# EAGLE design BEL (EAGLE 6.6.0)
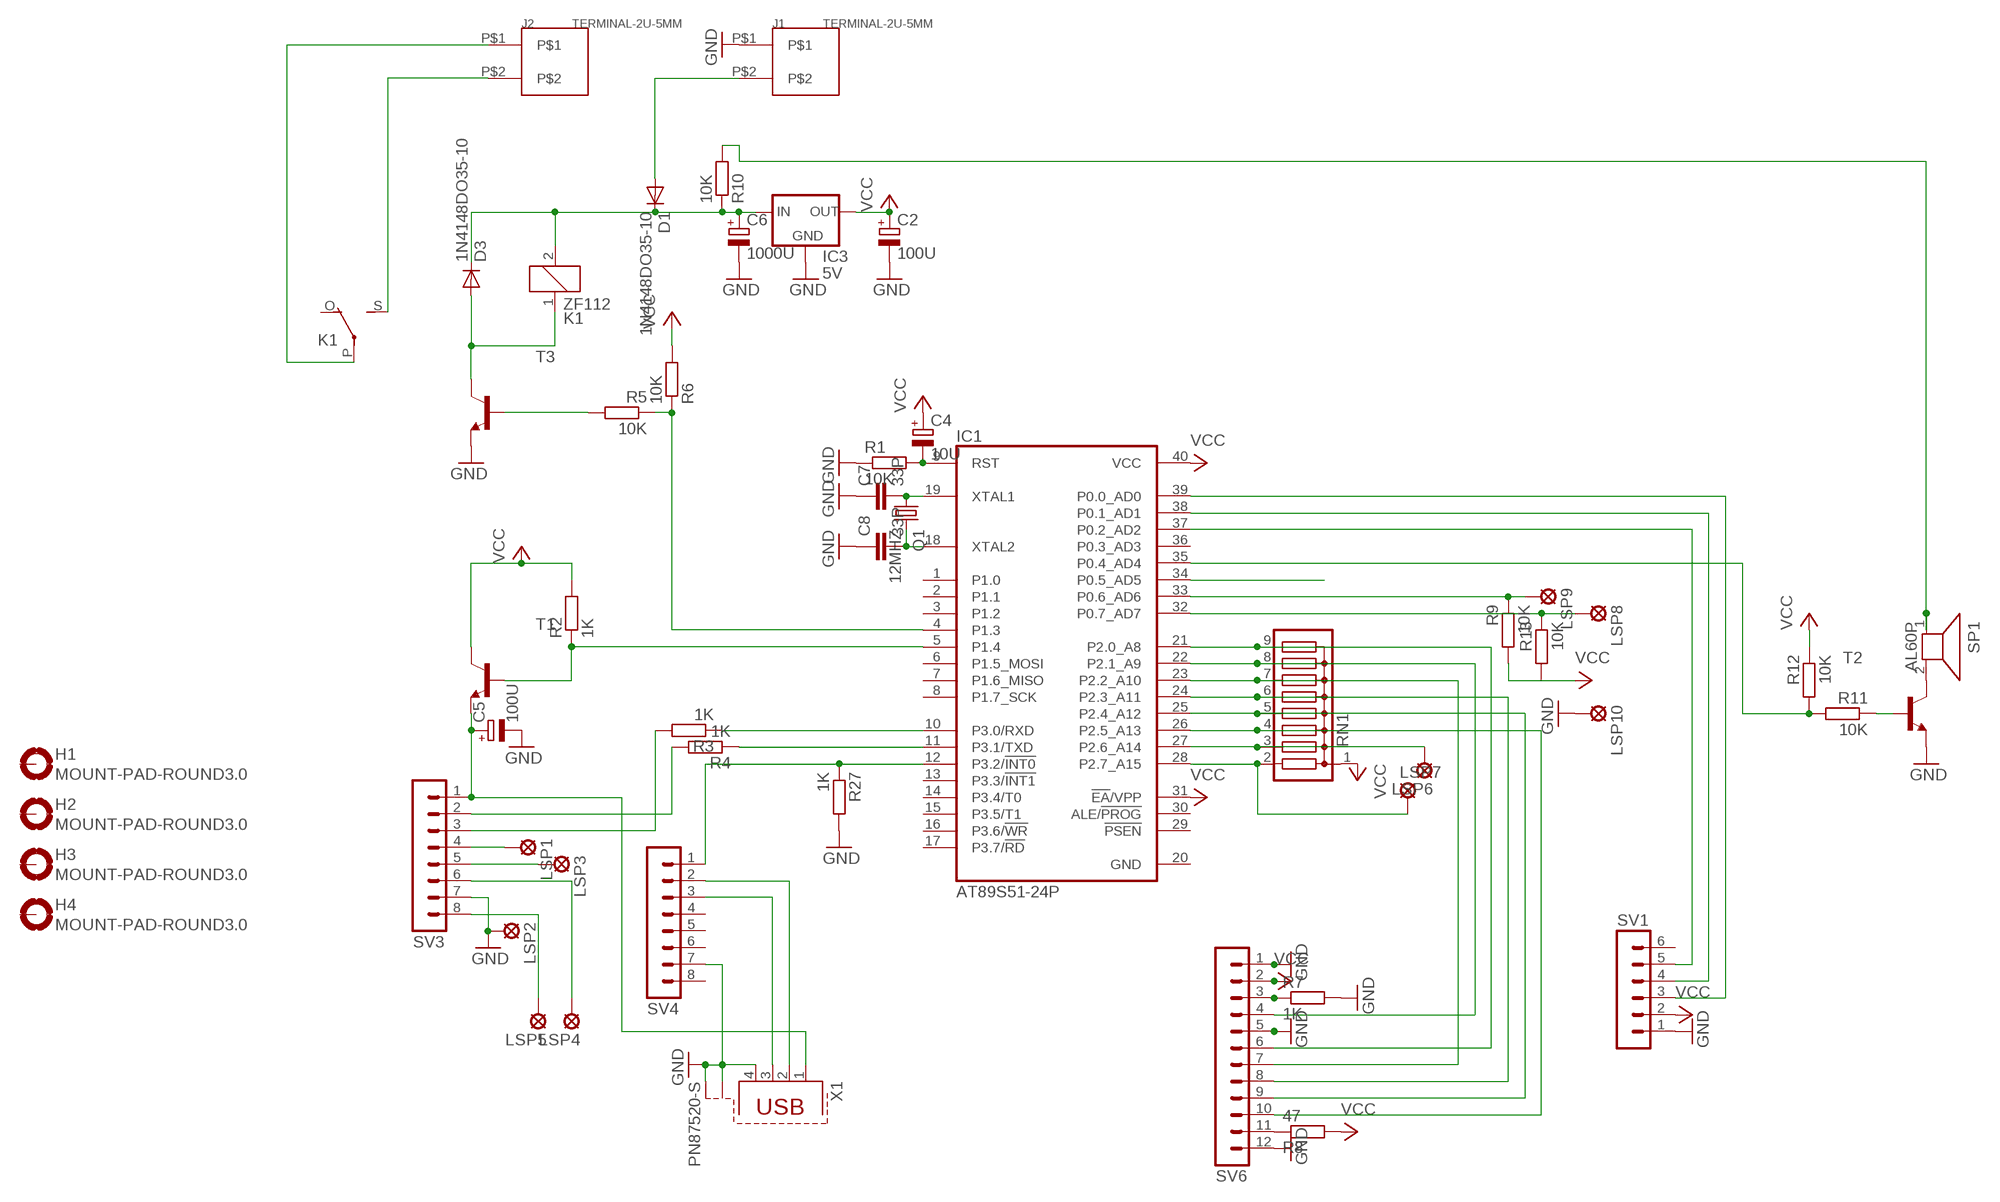
[diagram p0: schematic, sheet 1]

## Parts
C2  100U  CPOL-EUE2.5-5  [E2,5-5]
C4  10U  CPOL-EUE2.5-5  [E2,5-5]
C5  100U  CPOL-EUE2.5-5  [E2,5-5]
C6  1000U  CPOL-EUE5-8.5  [E5-8,5]
C7  33P  C-EU025-025X050  [C025-025X050]
C8  33P  C-EU025-025X050  [C025-025X050]
D1  1N4148DO35-10  [DO35-10]
D3  1N4148DO35-10  [DO35-10]
H1  MOUNT-PAD-ROUND3.0  [3,0-PAD]
H2  MOUNT-PAD-ROUND3.0  [3,0-PAD]
H3  MOUNT-PAD-ROUND3.0  [3,0-PAD]
H4  MOUNT-PAD-ROUND3.0  [3,0-PAD]
IC1  AT89S51-24P  [DIL40]
IC3  5V  78XXS  [78XXS]
J1  TERMINAL-2U-5MM  [TERMINAL-2U-5MM]
J2  TERMINAL-2U-5MM  [TERMINAL-2U-5MM]
K1  ZF112  [ZF112]
LSP1  SE11  [SE11]
LSP2  SE11  [SE11]
LSP3  SE11  [SE11]
LSP4  SE11  [SE11]
LSP5  SE11  [SE11]
LSP6  MCS10B  [MCS10B]
LSP7  MCS10B  [MCS10B]
LSP8  MCS10B  [MCS10B]
LSP9  MCS10B  [MCS10B]
LSP10  MCS10B  [MCS10B]
Q1  12MHZ  CRYSTALHC49S  [HC49/S]
R1  10K  R-EU_0207/10  [0207/10]
R2  1K  R-EU_0207/10  [0207/10]
R3  1K  R-EU_0207/10  [0207/10]
R4  1K  R-EU_0207/10  [0207/10]
R5  10K  R-EU_0207/10  [0207/10]
R6  10K  R-EU_0207/10  [0207/10]
R7  1K  R-EU_0207/10  [0207/10]
R8  47  R-EU_0207/10  [0207/10]
R9  10K  R-EU_0207/10  [0207/10]
R10  10K  R-EU_0207/10  [0207/10]
R11  10K  R-EU_0207/10  [0207/10]
R12  10K  R-EU_0207/10  [0207/10]
R13  10K  R-EU_0207/10  [0207/10]
R27  1K  R-EU_0207/10  [0207/10]
RN1  G08R  [SIL9]
SP1  AL60P  [AL60P]
SV1  MA06-1  [MA06-1]
SV3  MA08-1  [MA08-1]
SV4  MA08-1  [MA08-1]
SV6  MA12-1  [MA12-1]
T1  BC547-NPN-TO92-CBE  [TO92-CBE]
T2  BC547-NPN-TO92-CBE  [TO92-CBE]
T3  BC547-NPN-TO92-CBE  [TO92-CBE]
X1  PN87520-S  [PN87520-S]

## Nets
GND: C2.- C5.- C6.- C7.1 C8.1 IC3.GND J1.P$1 LSP2.MP LSP10.MP R1.1 R7.2 R27.2 SV1.1 SV3.7 SV4.7 SV6.1 SV6.5 SV6.12 T2.E T3.E X1.4 X1.S1 X1.S2
N$1: C8.2 IC1.18(XTAL2) Q1.2
N$2: C7.2 IC1.19(XTAL1) Q1.1
N$3: C4.- IC1.9(RST) R1.2
N$4: R10.2 SP1.1
N$5: D3.A K1.1 T3.C
N$6: C5.+ SV3.1 T1.E X1.1
N$7: IC1.5(P1.4) R2.1 T1.B
N$8: SP1.2 T2.C
N$9: R4.2 SV3.2
N$10: R3.2 SV3.3
N$11: IC1.11(P3.1/TXD) R4.1
N$12: IC1.10(P3.0/RXD) R3.1
N$13: IC1.12(P3.2/!INT0) R27.1 SV4.1
N$14: IC1.26(P2.5_A13) RN1.4 SV6.10
N$15: IC1.38(P0.1_AD1) SV1.4
N$16: SV4.2 X1.2
N$17: SV4.3 X1.3
N$18: LSP4.MP SV3.6
N$19: IC1.23(P2.2_A10) RN1.7 SV6.7
N$20: R5.2 T3.B
N$21: IC1.4(P1.3) R5.1 R6.1
N$22: D1.A J1.P$2
N$23: J2.P$2 K1.S(2:S)
N$24: J2.P$1 K1.P(2:P)
N$25: IC1.37(P0.2_AD2) SV1.5
N$27: R7.1 SV6.3
N$28: IC1.39(P0.0_AD0) SV1.3
N$29: R11.1 T2.B
N$30: C6.+ D1.C D3.C IC3.IN K1.2 R10.1
N$32: LSP5.MP SV3.8
N$33: LSP1.MP SV3.4
N$34: LSP3.MP SV3.5
N$37: R8.1 SV6.11
N$38: IC1.24(P2.3_A11) RN1.6 SV6.8
N$39: IC1.21(P2.0_A8) RN1.9 SV6.6
N$40: IC1.22(P2.1_A9) RN1.8 SV6.4
N$42: IC1.35(P0.4_AD4) R11.2 R12.2
N$43: IC1.34(P0.5_AD5)
N$44: IC1.33(P0.6_AD6) LSP9.MP R9.1
N$45: IC1.32(P0.7_AD7) LSP8.MP R13.1
N$46: IC1.28(P2.7_A15) LSP7.MP RN1.2
N$47: IC1.27(P2.6_A14) LSP6.MP RN1.3
N$49: IC1.25(P2.4_A12) RN1.5 SV6.9
VCC: C2.+ C4.+ IC1.31(!EA!/VPP) IC1.40(VCC) IC3.OUT R2.2 R6.2 R8.2 R9.2 R12.1 R13.2 RN1.1 SV1.2 SV6.2 T1.C
Unconnected: H1.B3,0(MOUNT) H2.B3,0(MOUNT) H3.B3,0(MOUNT) H4.B3,0(MOUNT) IC1.1(P1.0) IC1.2(P1.1) IC1.3(P1.2) IC1.6(P1.5_MOSI) IC1.7(P1.6_MISO) IC1.8(P1.7_SCK) IC1.13(P3.3/!INT1) IC1.14(P3.4/T0) IC1.15(P3.5/T1) IC1.16(P3.6/!WR) IC1.17(P3.7/!RD) IC1.29(!PSEN) IC1.30(ALE/!PROG) IC1.36(P0.3_AD3) K1.O(2:O) SV1.6 SV4.4 SV4.5 SV4.6 SV4.8

## Power pins joined to a net without a drawn wire
GND: IC1.20(GND)

## Library data of the parts
C2 C4-C6 = resistor:CPOL-EU: POLARIZED CAPACITOR, European symbol
C7 C8 = resistor:C-EU: CAPACITOR, European symbol
D1 D3 = diode:1N4148: DIODE high speed (Philips)
H1-H4 = holes:MOUNT-PAD-ROUND: MOUNTING PAD, round
IC1 = atmel:AT89S51-*: 8-bit Microcontroller with 4K BytesIn-System Programmable Flash Source: http://www.atmel.com/dyn/resources/prod_documents/doc2487.pdf; MPN: AT89S51-24PU; OC_FARNELL: 1095739; OC_NEWARK: 96K6578
IC3 = v-reg:78XXS: VOLTAGE REGULATOR
J1 J2 = Itead_BP_110825.lbr:TERMINAL-2U-5MM: CON001
K1 = relay:ZF112: RELAY 1 x switch; OC_FARNELL: unknown; OC_NEWARK: unknown
LSP1-LSP5 = solpad:SE11: SOLDER PAD RTM, drill 1,1mm, distributor Buerklin, 07F810
LSP6-LSP10 = solpad:MCS10B: SOLDER PAD MC S1, distributor Buerklin, 15F505
Q1 = crystal:CRYSTAL: CRYSTAL; OC_FARNELL: 1667008; OC_NEWARK: unknown
R1-R13 R27 = resistor:R-EU_: RESISTOR, European symbol
RN1 = resistor-sil:G08R: SIL RESISTOR; OC_FARNELL: unknown; OC_NEWARK: unknown
SP1 = buzzer:AL60P: SPEAKER Source: Buerklin; OC_FARNELL: unknown; OC_NEWARK: unknown
SV1 = con-lstb:MA06-1: PIN HEADER; OC_FARNELL: unknown; OC_NEWARK: unknown
SV3 SV4 = con-lstb:MA08-1: PIN HEADER; OC_FARNELL: unknown; OC_NEWARK: unknown
SV6 = con-lstb:MA12-1: PIN HEADER; OC_FARNELL: unknown; OC_NEWARK: unknown
T1-T3 = transistor:*-NPN-: NPN Transistror BF959 corrected 2008.03.06
X1 = con-berg:PN87520-S; OC_FARNELL: unknown; OC_NEWARK: unknown

## Board
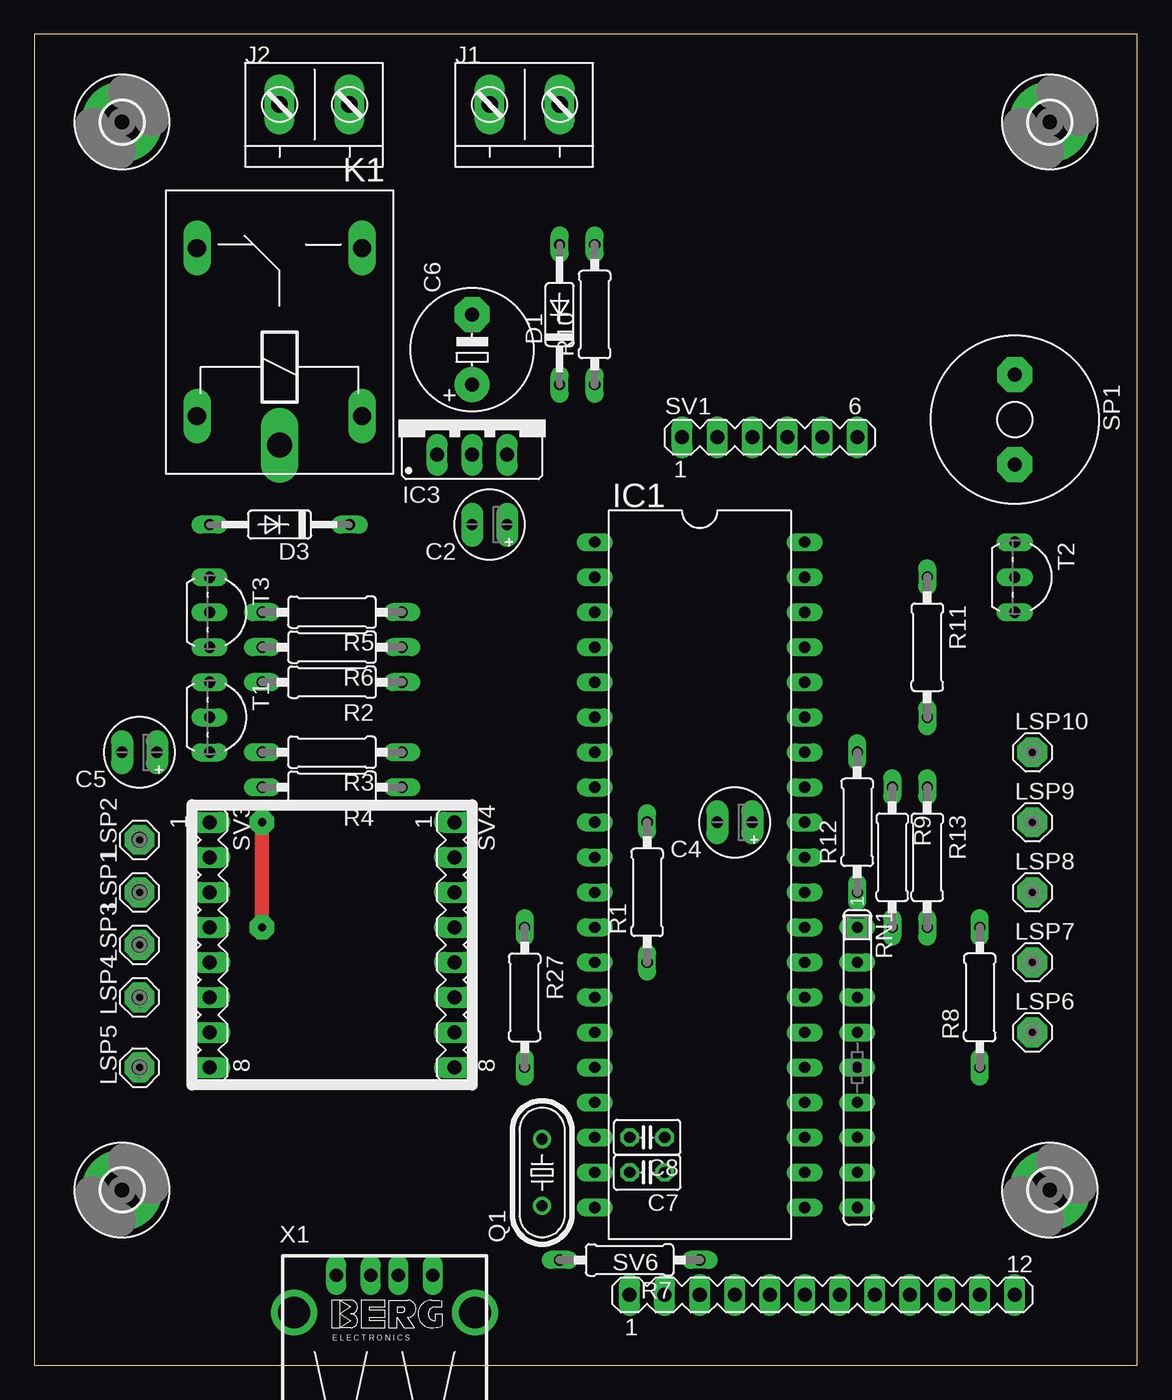
[diagram p1: board, top side]
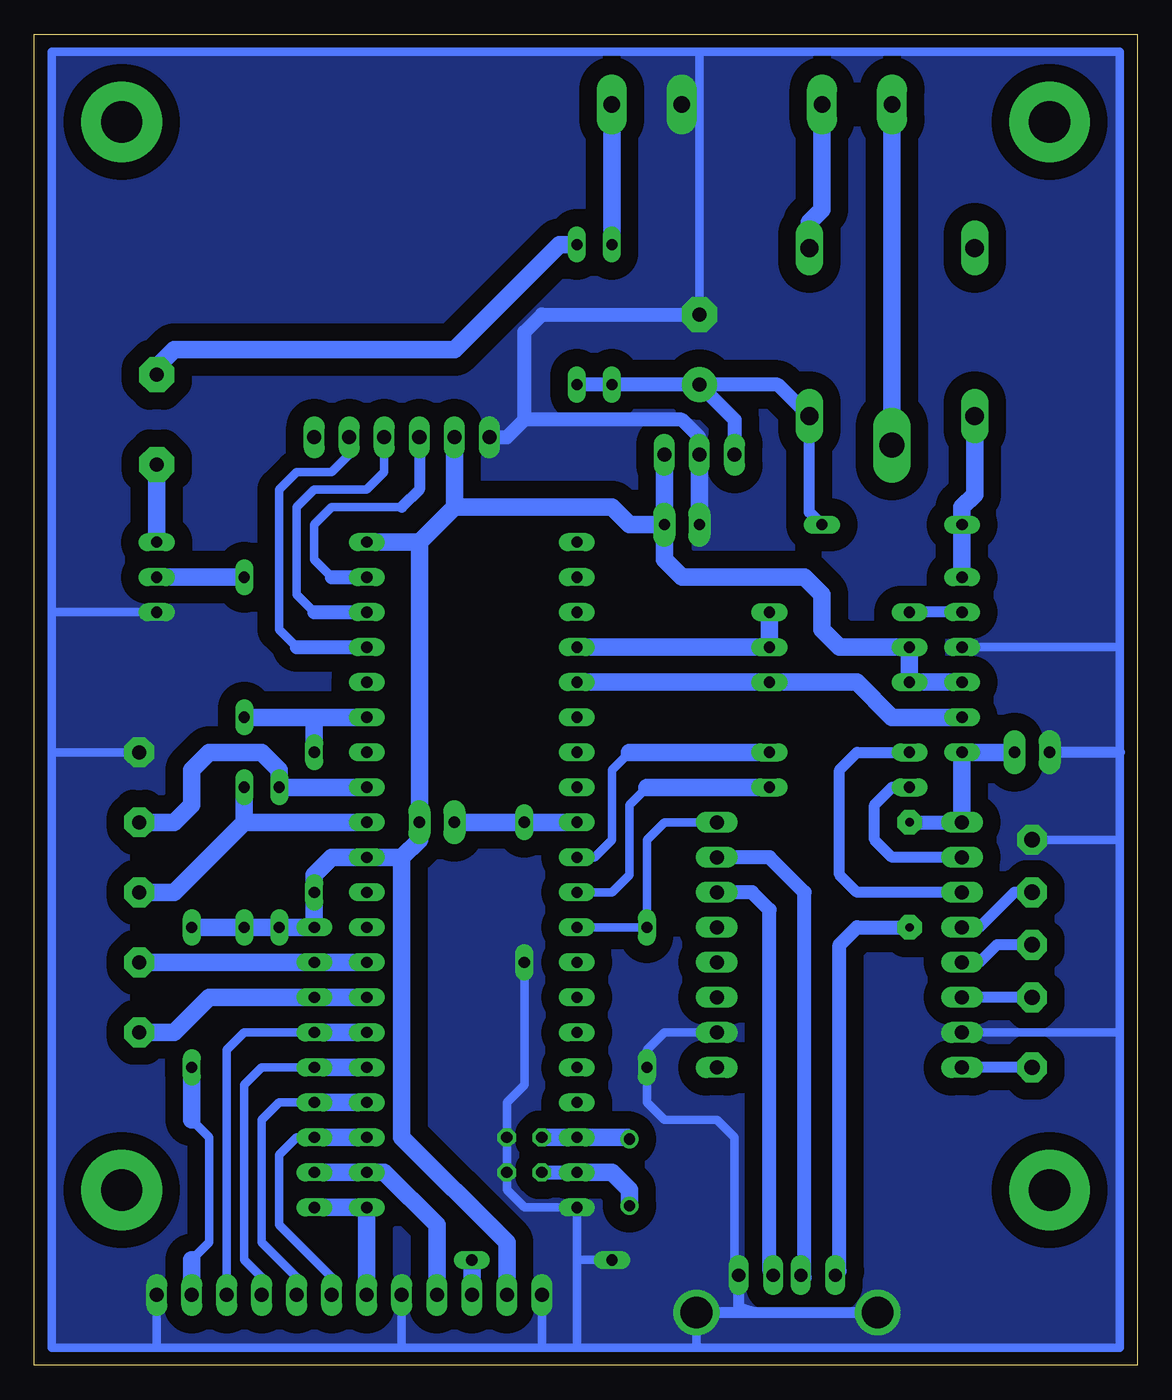
[diagram p2: board, bottom side, seen from below]

Size 79.99 x 96.52 mm. Coordinates in mm from the lower left corner, seen from the top.
Outline: 0,0 79.99,0 79.99,96.52 0,96.52 0,0
Copper layers (1*16): Top 0.035mm / dielectric 1.5mm / Bottom 0.035mm
Design rules "default": minimum track width 10mil, minimum drill 24mil, track to track 8mil, track to pad 8mil, pad to pad 8mil, via to via 8mil, smd to smd 8mil, copper to edge 40mil, drill to drill 8mil, minimum pad ring 10mil, minimum via ring 8mil, stop-mask expansion 4mil, vias tented up to drill 0mil, thermal gap 10mil

### Footprints (pad centres in the part's own frame; a part is rotated, then mirrored left to right if it is on the bottom)
E2,5-5 = drill 0.813 pad 1.6 long: + -1.27,0; - 1.27,0
E5-8,5 = drill 1.016 pad 2.54: + -2.54,0 | drill 1.016 pad 2.54 octagon: - 2.54,0
C025-025X050 = drill 0.813 octagon: 1 -1.27,0; 2 1.27,0
DO35-10 = drill 0.813 long: A 5.08,0; C -5.08,0
3,0-PAD = drill 3 pad 5.842: B3,0 0,0
DIL40 = drill 0.813 long: 1 -24.13,-7.62; 2 -21.59,-7.62; 3 -19.05,-7.62; 4 -16.51,-7.62; 5 -13.97,-7.62; 6 -11.43,-7.62; 7 -8.89,-7.62; 8 -6.35,-7.62; 9 -3.81,-7.62; 10 -1.27,-7.62; 11 1.27,-7.62; 12 3.81,-7.62; 13 6.35,-7.62; 14 8.89,-7.62; 15 11.43,-7.62; 16 13.97,-7.62; 17 16.51,-7.62; 18 19.05,-7.62; 19 21.59,-7.62; 20 24.13,-7.62; 21 24.13,7.62; 22 21.59,7.62; 23 19.05,7.62; 24 16.51,7.62; 25 13.97,7.62; 26 11.43,7.62; 27 8.89,7.62; 28 6.35,7.62; 29 3.81,7.62; 30 1.27,7.62; 31 -1.27,7.62; 32 -3.81,7.62; 33 -6.35,7.62; 34 -8.89,7.62; 35 -11.43,7.62; 36 -13.97,7.62; 37 -16.51,7.62; 38 -19.05,7.62; 39 -21.59,7.62; 40 -24.13,7.62
78XXS = drill 1.016 long: GND 0,-2.54; IN -2.54,-2.54; OUT 2.54,-2.54
TERMINAL-2U-5MM = drill 1.2 pad 2.184 long: P$1 2.54,5.08; P$2 7.62,5.08
ZF112 = drill 1.321 long: 1 -6.096,5.994; 2 -6.096,-5.994; O 6.096,5.994; S 6.096,-5.994 | drill 1.803 long: P -8.204,0
SE11 = drill 1.118 pad 2.159 octagon: MP 0,0
MCS10B = drill 1.016 pad 2.159 octagon: MP 0,0
HC49/S = drill 0.813: 1 -2.413,0; 2 2.413,0
0207/10 = drill 0.813 long: 1 -5.08,0; 2 5.08,0
SIL9 = drill 0.813 long: 1 -10.16,0; 2 -7.62,0; 3 -5.08,0; 4 -2.54,0; 5 0,0; 6 2.54,0; 7 5.08,0; 8 7.62,0; 9 10.16,0
AL60P = drill 1.016 pad 2.54 octagon: 1 -3.251,0; 2 3.251,0
MA06-1 = drill 1.016 long: 1 -6.35,0; 2 -3.81,0; 3 -1.27,0; 4 1.27,0; 5 3.81,0; 6 6.35,0
MA08-1 = drill 1.016 long: 1 -8.89,0; 2 -6.35,0; 3 -3.81,0; 4 -1.27,0; 5 1.27,0; 6 3.81,0; 7 6.35,0; 8 8.89,0
MA12-1 = drill 1.016 long: 1 -13.97,0; 2 -11.43,0; 3 -8.89,0; 4 -6.35,0; 5 -3.81,0; 6 -1.27,0; 7 1.27,0; 8 3.81,0; 9 6.35,0; 10 8.89,0; 11 11.43,0; 12 13.97,0
TO92-CBE = drill 0.813 long: B 0,0; C -2.54,0; E 2.54,0
PN87520-S = drill 0.95 long: 1 -3.5,2.71; 2 -1,2.71; 3 1,2.71; 4 3.5,2.71 | drill 2.3 pad 2.9: S1 -6.57,0; S2 6.57,0

### Placement (x,y rotation side)
C2  33.02,60.96 180 top
C4  50.8,39.37 180 top
C5  7.62,44.45 180 top
C6  31.75,73.66 90 top
C7  44.45,13.97 180 top
C8  44.45,16.51 180 top
D1  38.1,76.2 90 top
D3  17.78,60.96 180 top
H1  6.35,12.7 0 top
H2  73.66,12.7 0 top
H3  6.35,90.17 0 top
H4  73.66,90.17 0 top
IC1  48.26,35.56 270 top
IC3  31.75,68.58 0 top
J1  30.48,86.36 0 top
J2  15.24,86.36 0 top
K1  17.78,74.93 90 top
LSP1  7.62,34.29 90 top
LSP2  7.62,38.1 90 top
LSP3  7.62,30.48 90 top
LSP4  7.62,26.67 90 top
LSP5  7.62,21.59 90 top
LSP6  72.39,24.13 0 top
LSP7  72.39,29.21 0 top
LSP8  72.39,34.29 0 top
LSP9  72.39,39.37 0 top
LSP10  72.39,44.45 0 top
Q1  36.83,13.97 90 top
R1  44.45,34.29 90 top
R2  21.59,49.53 180 top
R3  21.59,44.45 180 top
R4  21.59,41.91 180 top
R5  21.59,54.61 180 top
R6  21.59,52.07 180 top
R7  43.18,7.62 180 top
R8  68.58,26.67 90 top
R9  62.23,36.83 270 top
R10  40.64,76.2 90 top
R11  64.77,52.07 270 top
R12  59.69,39.37 90 top
R13  64.77,36.83 270 top
R27  35.56,26.67 270 top
RN1  59.69,21.59 270 top
SP1  71.12,68.58 270 top
SV1  53.34,67.31 0 top
SV3  12.7,30.48 270 top
SV4  30.48,30.48 270 top
SV6  57.15,5.08 0 top
T1  12.7,46.99 270 top
T2  71.12,57.15 270 top
T3  12.7,54.61 270 top
X1  25.4,3.81 0 top

### Tracks (layer width: path | path; a pad name or v marks a point on that pad's centre or on a via)
GND
  Bottom 0.61: 40.64,1.27 40.64,7.62 | 40.64,7.62 IC1.20 44.45,11.43 45.72,12.7 C7.1 C8.1 45.72,19.05 44.45,20.32 R1.1 | 40.64,1.27 43.18,1.27 | 43.18,1.27 53.34,1.27 | 53.34,1.27 71.12,1.27 | 71.12,1.27 78.74,1.27 78.74,44.45 | 78.74,44.45 78.74,54.61 | 78.74,54.61 78.74,95.25 31.75,95.25 | 31.75,95.25 1.27,95.25 1.27,52.07 | 1.27,24.13 1.27,1.27 31.75,1.27 | 1.27,24.13 1.27,38.1 | 1.27,38.1 1.27,44.45 1.27,52.07 | 31.75,1.27 40.64,1.27 | X1.S2 31.97,1.49 31.75,1.27 | 1.27,52.07 T3.E | 1.27,24.13 SV3.7 | 31.75,95.25 31.75,91.44 | 31.75,91.44 C6.- | 31.75,91.44 J1.P$1 | SV4.7 34.29,24.13 35.56,22.86 R27.2 35.56,19.05 34.29,17.78 30.48,17.78 29.21,16.51 29.21,6.83 X1.4 | LSP2.MP 1.27,38.1 | T2.E 78.74,54.61 | SV6.1 43.18,1.27 | SV6.5 53.34,1.27 | R7.2 40.64,7.62 | SV6.12 71.12,1.27 | LSP10.MP 78.74,44.45
  Bottom 0.813: 27.94,3.81 X1.S1 | X1.S2 27.94,3.81 | X1.4 28.9,4.12 27.94,3.81 | 1.27,44.45 C5.-
  Bottom 1.016: IC3.GND 31.75,67.31 33.02,68.58 44.45,68.58 | 44.45,68.58 44.45,74.93 43.18,76.2 C6.- | SV1.1 45.72,67.31 44.45,68.58
  Bottom 1.27: IC3.GND C2.-
  pour Bottom (isolate 1.27, no thermals): 0,0 0,96.52 80.01,96.52 80.01,0
N$1
  Bottom 1.27: C8.2 IC1.18 36.96,16.51 Q1.2
N$2
  Bottom 1.016: C7.2 IC1.19
  Bottom 1.27: IC1.19 38.1,13.97 36.83,12.7 Q1.1
N$3
  Bottom 1.27: C4.- R1.2 IC1.9
N$4
  Bottom 1.27: R10.2 41.91,81.28 49.53,73.66 69.85,73.66 71.12,72.39 SP1.1
N$5
  Bottom 1.27: T3.C D3.A 12.7,62.23 11.79,63.14 K1.1
N$6  (via drill 0.6 pad 1.78)
  Top 1.016: v16.51,31.75 v16.51,39.37
  Bottom 0.813: X1.1 21.9,6.04 21.59,6.35
  Bottom 1.016: v16.51,39.37 SV3.1 | v16.51,31.75 20.32,31.75 21.59,30.48 21.59,6.83 X1.1
  Bottom 1.27: C5.+ T1.E SV3.1
N$7
  Bottom 1.27: T1.B 17.78,46.99 20.32,49.53 R2.1 IC1.5
N$8
  Bottom 1.27: T2.C SP1.2
N$9
  Bottom 0.813: R4.2 17.78,41.91 19.05,40.64 19.05,38.1 17.78,36.83 SV3.2
N$10
  Bottom 0.813: R3.2 20.32,44.45 21.59,43.18 21.59,35.56 20.32,34.29 SV3.3
N$11
  Bottom 0.61: IC1.11 38.1,34.29 36.83,35.56 36.83,40.64 35.56,41.91
  Bottom 1.27: 35.56,41.91 R4.1
N$12
  Bottom 0.61: IC1.10 39.37,36.83 38.1,38.1 38.1,43.18 36.83,44.45
  Bottom 1.27: 36.83,44.45 R3.1
N$13
  Bottom 0.61: SV4.1 34.29,39.37 35.56,38.1 R27.1 IC1.12
N$14
  Bottom 0.61: RN1.4 64.77,24.13 66.04,22.86 SV6.10
  Bottom 1.27: RN1.4 IC1.26
N$15
  Bottom 0.61: SV1.4 54.61,64.77 55.88,63.5 59.69,63.5 60.96,62.23 60.96,55.88 59.69,54.61
  Bottom 1.016: 59.69,54.61 IC1.38
N$16
  Bottom 1.016: X1.2 24.4,6.62 24.13,6.35 24.13,34.29 26.67,36.83 SV4.2
N$17
  Bottom 1.016: SV4.3 27.94,34.29 26.67,33.02 26.67,6.79 X1.3
N$18
  Bottom 0.813: LSP4.MP SV3.6
N$19
  Bottom 0.61: SV6.7 58.42,6.35 62.23,10.16 62.23,15.24 60.96,16.51 RN1.7
  Bottom 1.27: IC1.23 RN1.7
N$20
  Bottom 0.813: T3.B R5.2
N$21
  Bottom 1.27: IC1.4 R6.1 R5.1
N$22
  Bottom 1.27: D1.A J1.P$2
N$23
  Bottom 1.27: K1.S 23.77,82.91 22.86,83.82 J2.P$2
N$24
  Bottom 1.27: K1.P J2.P$1
N$25
  Bottom 0.61: SV1.5 57.15,66.04 58.42,64.77 60.96,64.77 62.23,63.5 62.23,53.34 60.96,52.07
  Bottom 1.016: 60.96,52.07 IC1.37
N$27
  Bottom 1.27: SV6.3 R7.1
N$28
  Bottom 0.61: 53.34,62.23 58.42,62.23 59.69,60.96 59.69,58.42 58.42,57.15
  Bottom 0.813: SV1.3 52.07,63.5 53.34,62.23
  Bottom 1.016: 58.42,57.15 IC1.39
N$29
  Bottom 1.27: R11.1 T2.B
N$30
  Bottom 0.813: K1.2 23.77,61.87 D3.C
  Bottom 1.016: C6.+ D1.C R10.1 | C6.+ 26.06,71.12 K1.2 | IC3.IN 29.21,68.58 C6.+
N$32
  Bottom 0.813: LSP5.MP SV3.8
N$33
  Bottom 0.813: SV3.4 11.43,31.75 8.89,34.29 LSP1.MP
N$34
  Bottom 0.813: SV3.5 11.43,29.21 10.16,30.48 LSP3.MP
N$37
  Bottom 0.61: 68.58,7.62 67.31,8.89 67.31,16.51 68.58,17.78
  Bottom 1.27: SV6.11 68.58,7.62 | R8.1 68.58,17.78
N$38
  Bottom 0.61: SV6.8 60.96,6.35 63.5,8.89 63.5,17.78 62.23,19.05 RN1.6
  Bottom 1.27: RN1.6 IC1.24
N$39
  Bottom 1.27: RN1.9 IC1.21 SV6.6
N$40
  Bottom 1.27: RN1.8 IC1.22 54.61,13.97 50.8,10.16 SV6.4
N$42
  Bottom 1.27: 59.69,46.99 R11.2 | R12.2 59.69,46.99 | 59.69,46.99 IC1.35
N$44
  Bottom 1.27: IC1.33 R9.1 62.23,43.18 63.5,44.45 67.31,44.45 68.58,43.18 68.58,40.64 69.85,39.37 LSP9.MP
N$45
  Bottom 1.27: IC1.32 64.77,39.37 | 64.77,39.37 69.85,34.29 LSP8.MP | R13.1 64.77,39.37
N$46
  Bottom 1.27: IC1.28 RN1.2 LSP7.MP
N$47
  Bottom 1.27: IC1.27 RN1.3 67.31,26.67 69.85,24.13 LSP6.MP
N$49
  Bottom 0.61: RN1.5 63.5,21.59 64.77,20.32 64.77,7.62 63.5,6.35 SV6.9
  Bottom 1.27: IC1.25 RN1.5
VCC
  Bottom 1.27: 53.34,36.83 IC1.31 58.42,36.83 59.69,35.56 R12.1 RN1.1 R9.2 R13.2 R8.2 | 53.34,36.83 52.07,38.1 C4.+ 52.07,59.69 | 52.07,59.69 IC1.40 | SV1.2 49.53,62.23 | 49.53,62.23 38.1,62.23 36.83,60.96 C2.+ | 52.07,59.69 49.53,62.23 | IC3.OUT C2.+ | C2.+ 34.29,58.42 33.02,57.15 24.13,57.15 22.86,55.88 22.86,53.34 21.59,52.07 R6.2 R2.2 T1.C | SV6.2 45.72,8.89 53.34,16.51 53.34,36.83